# Altium schematic sheet 10)USB HOST,USB Device,.SchDoc
size 297 x 209 mm
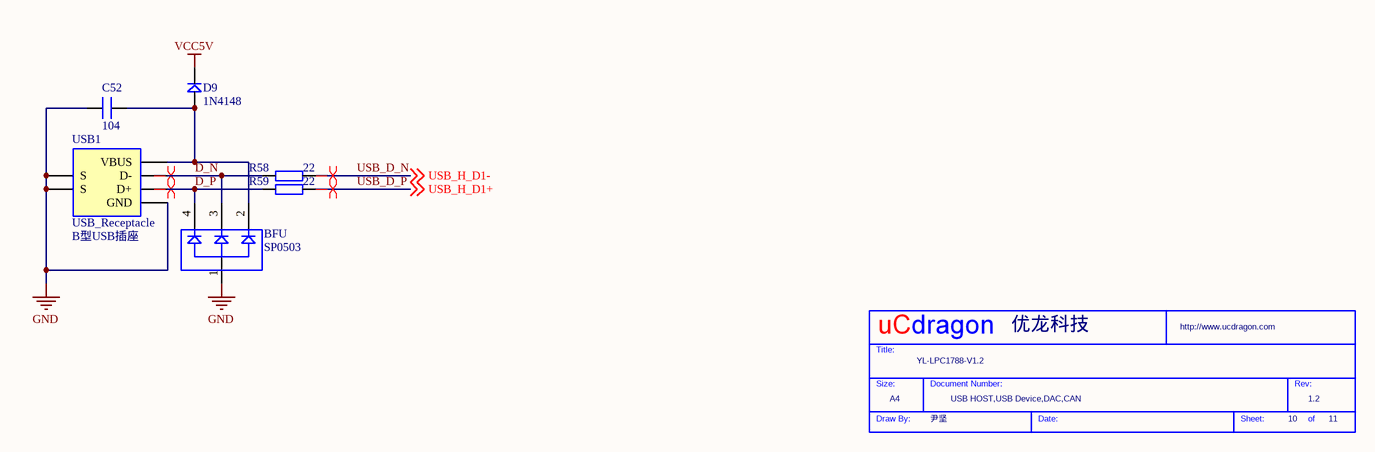
[diagram p0: 10)USB HOST,USB Device,.SchDoc]

## Parts
*  Page Count: 11  Page Number: 10  Page Size: A4  Title: YL-LPC1788-V1.2  RevCode: 1.2  Doc: USB HOST,USB Device,DAC,CAN  Drawing: 尹坚  Company: 优龙科技  (hidden comment: My Title 0)  (graphical)
BFU  SP0503  [SOT143]
C52  104  [0603P]
D9  1N4148  [DIODE_SOP]
R58  22  [0603P]
R59  22  [0603P]
USB1  USB_Receptacle  value B型USB插座  [Micro_USB]

## Nets
GND: BFU.1 C52.1 USB1.4(GND) USB1.5(S) USB1.6(S)
VCC5V: D9.2
D_N: BFU.3 R58.1 USB1.2(D-)
D_P: BFU.4 R59.1 USB1.3(D+)
USB_D_N: R58.2 ; off-sheet USB_H_D1-  [also labelled USB_H_D1-]
USB_D_P: R59.2 ; off-sheet USB_H_D1+  [also labelled USB_H_D1+]
NetBFU_2: BFU.2 C52.2 D9.1 USB1.1(VBUS)

## Layout directives
differential pair: (no net found under the mark), USB_D_N, USB_D_P

## Notes on the sheet
- (in symbol My Title 0) Title:; Size:; Document Number:; Rev:; Draw By:; Date:; Sheet:; of

## Library data of the parts
BFU = SP0503: Capacitor; Published: *; Publisher: *; Manufacturer: *; Class: *; SubClass: *; Value: *
C52 = C_2
D9 = D
R58 R59 = R
USB1 = 300008272: B型USB插座，Series “B” Receptacles，Right Angle, T/H，4POS; Part name: USB插座; ID: 273; Part Number: 300008272; Part Type: USB插座; DataSheet: \\dsvr\1_研发团队\1_研发资源\HW\Lib_Datasheet\conn\usb\UC11123-LK1-4F_B_type.pdf
* = My Title 0: Page Create Date: May 29, 2006; WebSite: http://www.ucdragon.com